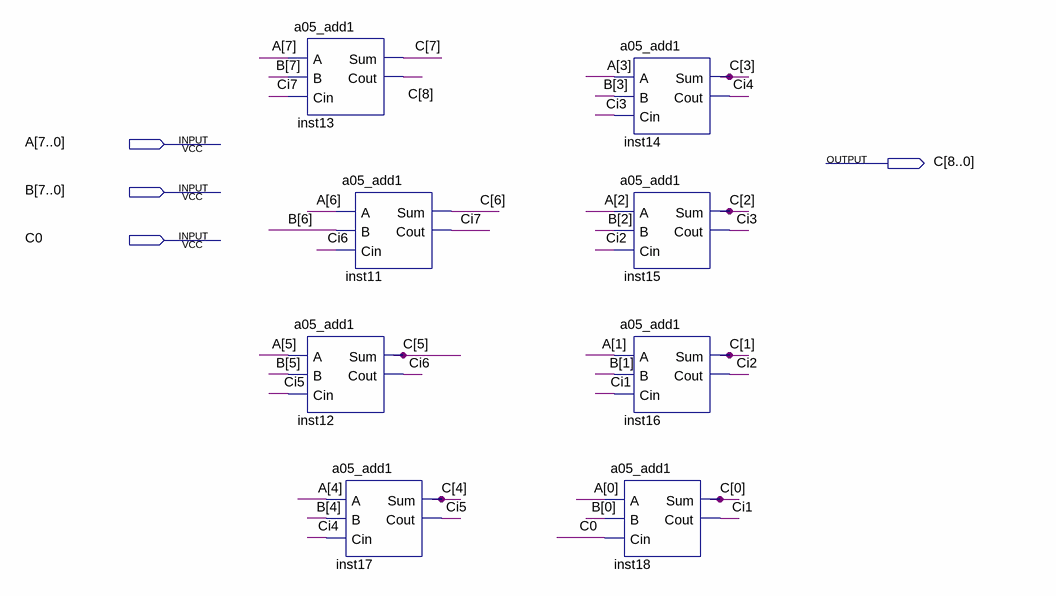
[diagram p0: schematic sheet]
// Quartus schematic a05_adder.bdf as structural Verilog: 8 symbols, 4 pins
module a05_adder (
  input  [7:0] A,
  input  [7:0] B,
  input  C0,
  output [8:0] C
);

  wire Ci1, Ci2, Ci3, Ci4, Ci5, Ci6, Ci7;

  a05_add1 inst13 (.A(A[7]), .B(B[7]), .Cin(Ci7), .Sum(C[7]), .Cout(C[8]));
  a05_add1 inst12 (.A(A[5]), .B(B[5]), .Cin(Ci5), .Sum(C[5]), .Cout(Ci6));
  a05_add1 inst11 (.A(A[6]), .B(B[6]), .Cin(Ci6), .Sum(C[6]), .Cout(Ci7));
  a05_add1 inst17 (.A(A[4]), .B(B[4]), .Cin(Ci4), .Sum(C[4]), .Cout(Ci5));
  a05_add1 inst14 (.A(A[3]), .B(B[3]), .Cin(Ci3), .Sum(C[3]), .Cout(Ci4));
  a05_add1 inst15 (.A(A[2]), .B(B[2]), .Cin(Ci2), .Sum(C[2]), .Cout(Ci3));
  a05_add1 inst16 (.A(A[1]), .B(B[1]), .Cin(Ci1), .Sum(C[1]), .Cout(Ci2));
  a05_add1 inst18 (.A(A[0]), .B(B[0]), .Cin(C0), .Sum(C0), .Cout(Ci1));

  assign C[0] = C0;
endmodule
